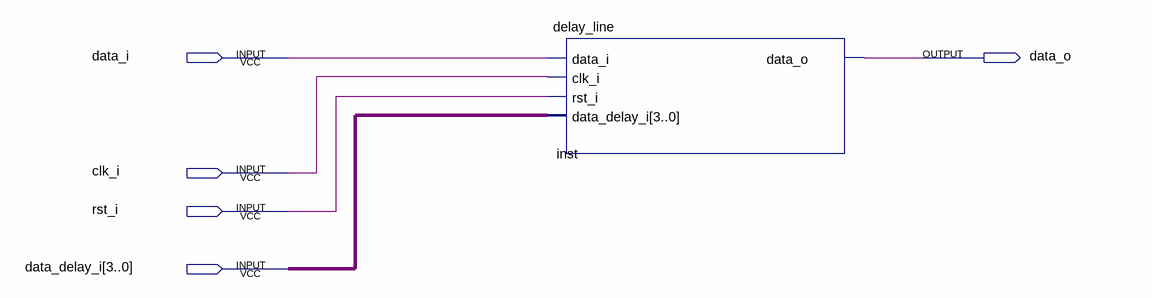
[diagram p0: schematic sheet]
// Quartus schematic top.bdf as structural Verilog: 1 symbols, 5 pins
module top (
  input  data_i,
  input  clk_i,
  input  rst_i,
  input  [3:0] data_delay_i,
  output data_o
);

  delay_line inst (.data_i(data_i), .clk_i(clk_i), .rst_i(rst_i), .data_delay_i(data_delay_i), .data_o(data_o));
endmodule
